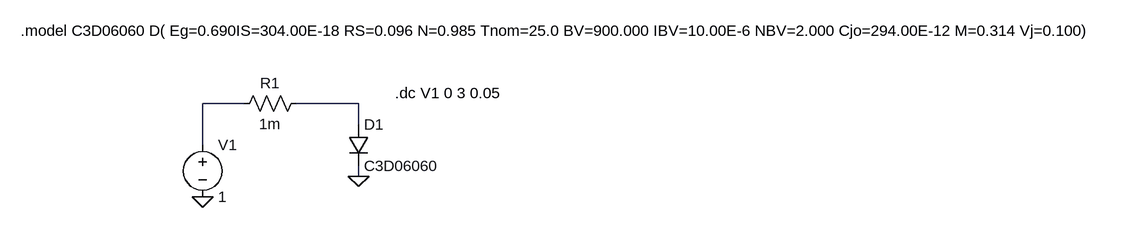
[diagram p0: schematic diode_current_vs_voltage.asc]
diode_current_vs_voltage.asc, the LTspice schematic file:
Version 4
SHEET 1 1544 680
WIRE 80 48 16 48
WIRE 256 48 160 48
WIRE 256 80 256 48
WIRE 16 112 16 48
WIRE 256 160 256 144
FLAG 16 192 0
FLAG 256 160 0
SYMBOL diode 240 80 R0
SYMATTR InstName D1
SYMATTR Value C3D06060
SYMBOL voltage 16 96 R0
WINDOW 123 0 0 Left 0
WINDOW 39 0 0 Left 0
SYMATTR InstName V1
SYMATTR Value 1
SYMBOL res 176 32 R90
WINDOW 0 0 56 VBottom 2
WINDOW 3 32 56 VTop 2
SYMATTR InstName R1
SYMATTR Value 1m
TEXT -264 -64 Left 2 !.model C3D06060 D( Eg=0.690IS=304.00E-18 RS=0.096 N=0.985 Tnom=25.0 BV=900.000 IBV=10.00E-6 NBV=2.000 Cjo=294.00E-12 M=0.314 Vj=0.100)
TEXT 312 32 Left 2 !.dc V1 0 3 0.05

The netlist it stands for:
* diode_current_vs_voltage.asc
D1 N002 0 C3D06060
V1 N001 0 1
R1 N002 N001 1m
.model D D
.lib standard.dio
.model C3D06060 D( Eg=0.690IS=304.00E-18 RS=0.096 N=0.985 Tnom=25.0 BV=900.000 IBV=10.00E-6 NBV=2.000 Cjo=294.00E-12 M=0.314 Vj=0.100)
.dc V1 0 3 0.05
.backanno
.end